# EAGLE design 104_angle (EAGLE 7.6.0)
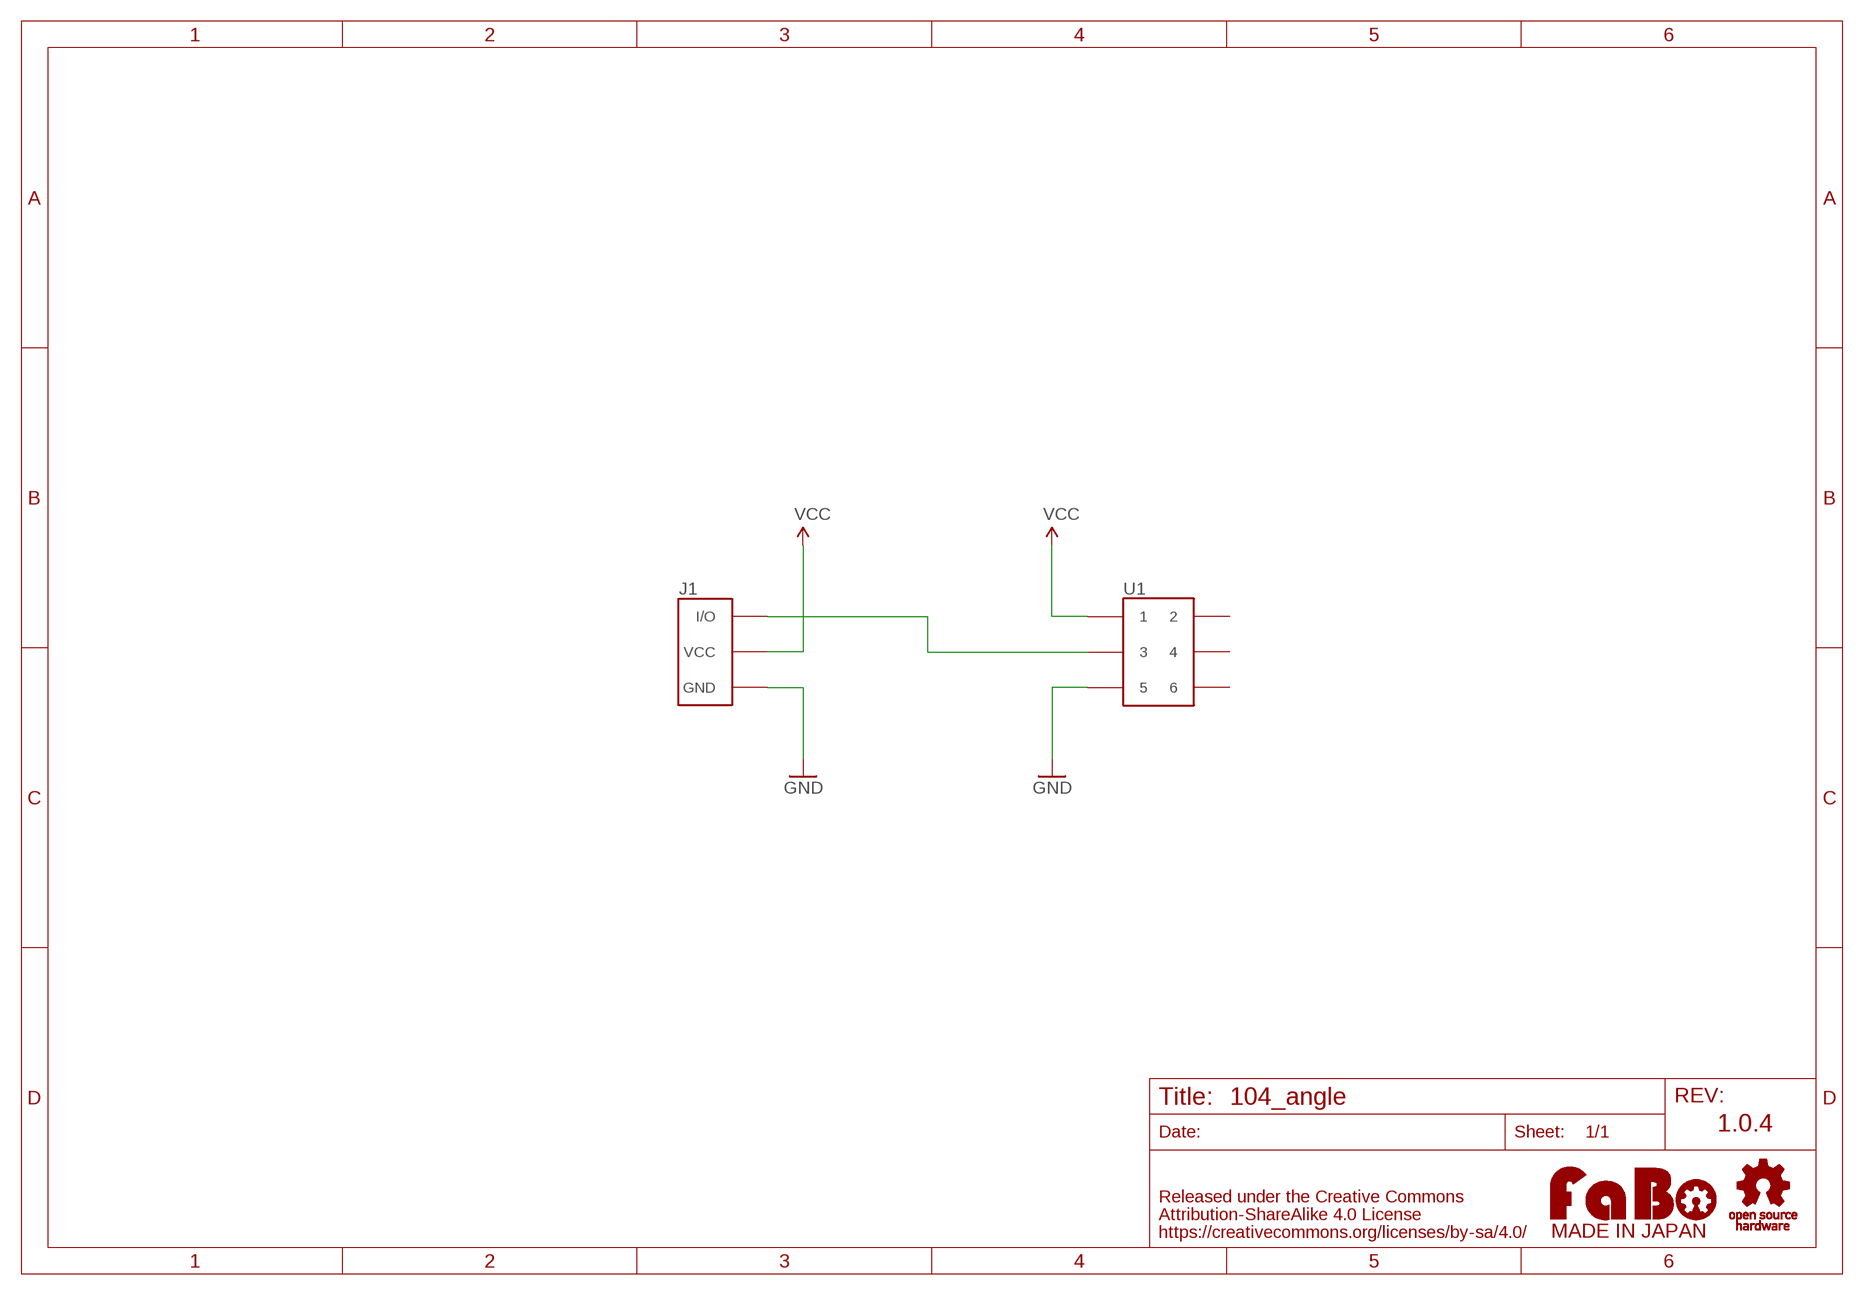
[diagram p0: schematic, sheet 1]

## Parts
J1  FABO_BRICK_3PIN  [FABO_BRICK_3PIN]
U1  ROTARYENCORDER  [ROTARYENCORDER]
U$2  LOGO_FABO-M  [LOGO_FABO_MS]
U$3  LOGO_OSHW-M_BOTTOM  [LOGO_OSHW_M_BOTTOM]

## Nets
GND: J1.GND U1.5
N$1: J1.I/O U1.3
VCC: J1.VCC U1.1
Unconnected: U1.2 U1.4 U1.6

## Notes on the sheet
- 1.0.4

## Library data of the parts
J1 = FaBo-Template:FABO_BRICK_3PIN: FaBo Brick 3pin
U1 = FaBo-Parts:ROTARYENCORDER
U$2 = FaBo-etc:LOGO_FABO
U$3 = FaBo-etc:LOGO_OSHW

## Board
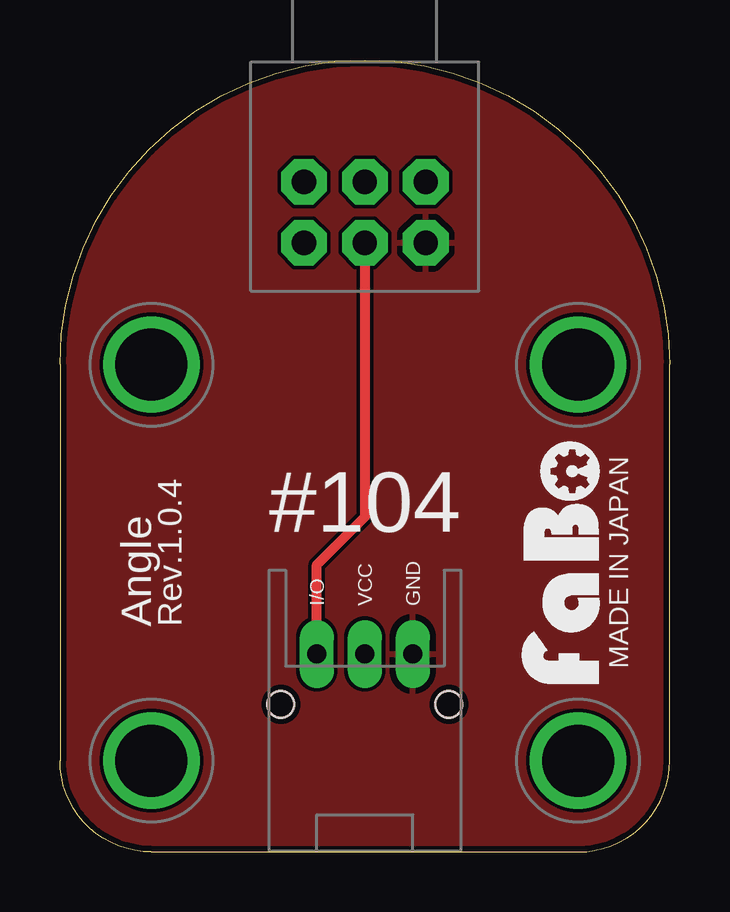
[diagram p1: board, top side]
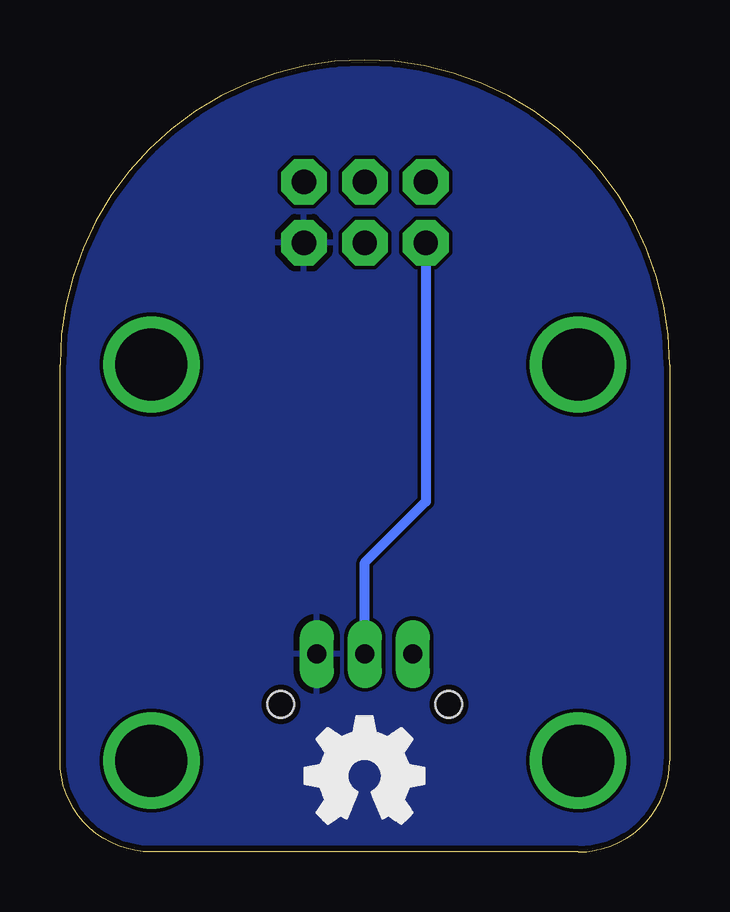
[diagram p2: board, bottom side, seen from below]

Size 25.4 x 33.02 mm. Coordinates in mm from the lower left corner, seen from the top.
Copper layers (1*16): Top 0.035mm / dielectric 1.5mm / Bottom 0.035mm
Design rules "SeeedStudio_2layer_DRU_no_angle_20140221": minimum track width 6mil, minimum drill 12mil, track to track 6mil, track to pad 6mil, pad to pad 6mil, via to via 6mil, smd to smd 0mil, copper to edge 10mil, drill to drill 10mil, minimum pad ring 10mil, minimum via ring 6mil, stop-mask expansion 2mil, vias tented up to drill 100mil, thermal gap 10mil

### Footprints (pad centres in the part's own frame; a part is rotated, then mirrored left to right if it is on the bottom)
FABO_BRICK_3PIN = drill 0.8 pad 1.422 long: GND 2,-8.255; I/O -2,-8.255; VCC 0,-8.255 | drill 3 pad 3.81: P$1 -8.89,3.81; P$2 8.89,3.81; P$3 -8.89,-12.7; P$4 8.89,-12.7 | hole 1.1: -3.5,-10.355; 3.5,-10.355
ROTARYENCORDER = drill 1.016 pad 1.9 octagon: 1 -2.54,-1.27; 2 -2.54,1.27; 3 0,-1.27; 4 0,1.27; 5 2.54,-1.27; 6 2.54,1.27

### Placement (x,y rotation side)
J1  12.7,16.51 0 top
U1  12.7,26.67 0 top
U$2  22.86,12.06 90 top
U$3  12.7,3.17 0 top

### Tracks (layer width: path | path; a pad name or v marks a point on that pad's centre or on a via)
GND
  pour Bottom: 0,0 25.4,0 25.4,33.02 0,33.02
  pour Top: 0,0 25.4,0 25.4,33.02 0,33.02
N$1
  Top 0.406: U1.3 12.7,13.97 10.7,11.97 J1.I/O
VCC
  Bottom 0.406: U1.1 10.16,14.61 12.7,12.06 J1.VCC

### Text on the board
tPlace: #104 | MADE IN JAPAN | Angle | Rev.1.0.4